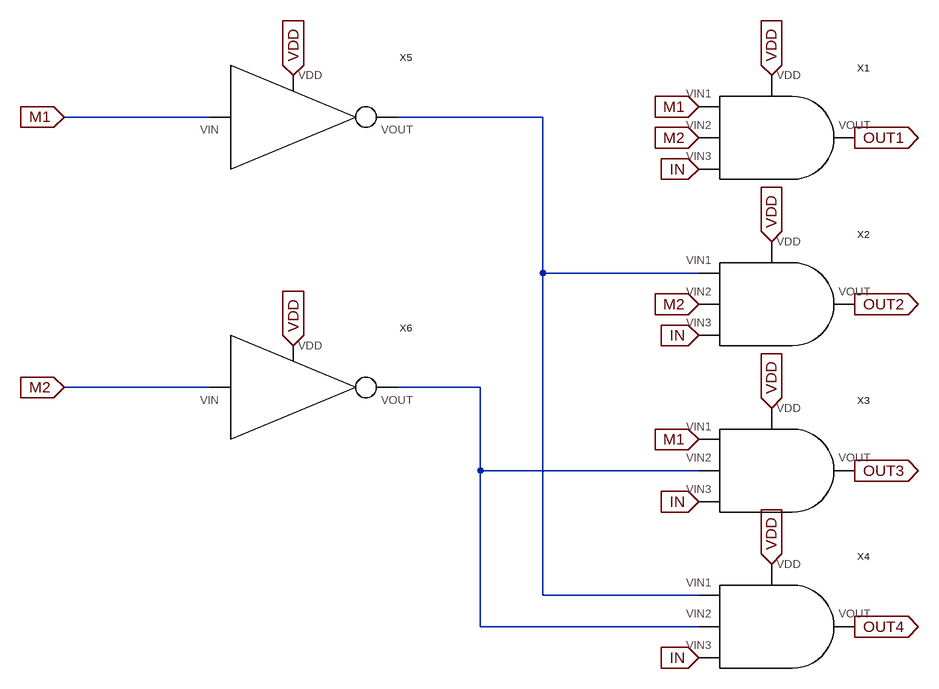
[diagram p0: schematic demultiplexer.asc]
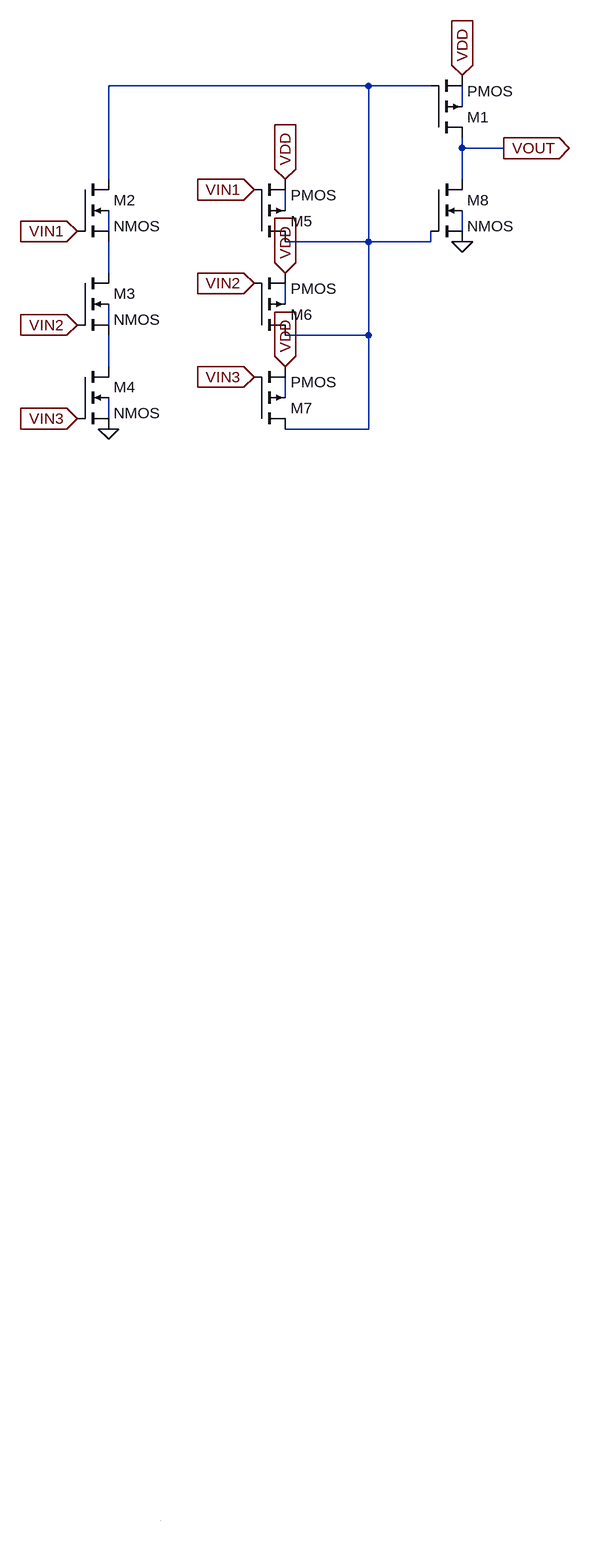
[diagram p1: sub-circuit and3.asc]
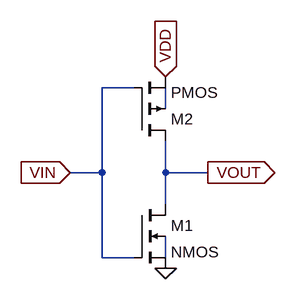
[diagram p2: sub-circuit not.asc]
demultiplexer.asc, the LTspice schematic file:
Version 4
SHEET 1 1080 680
WIRE -1040 -320 -1264 -320
WIRE -528 -320 -752 -320
WIRE -528 -80 -528 -320
WIRE -288 -80 -528 -80
WIRE -1040 96 -1264 96
WIRE -624 96 -752 96
WIRE -624 224 -624 96
WIRE -288 224 -624 224
WIRE -528 416 -528 -80
WIRE -288 416 -528 416
WIRE -624 464 -624 224
WIRE -288 464 -624 464
FLAG -176 -384 VDD
IOPIN -176 -384 In
FLAG -176 -128 VDD
IOPIN -176 -128 In
FLAG -176 128 VDD
IOPIN -176 128 In
FLAG -176 368 VDD
IOPIN -176 368 In
FLAG -912 32 VDD
IOPIN -912 32 In
FLAG -912 -384 VDD
IOPIN -912 -384 In
FLAG -1264 -320 M1
IOPIN -1264 -320 In
FLAG -288 -336 M1
IOPIN -288 -336 In
FLAG -288 176 M1
IOPIN -288 176 In
FLAG -1264 96 M2
IOPIN -1264 96 In
FLAG -288 -288 M2
IOPIN -288 -288 In
FLAG -288 -32 M2
IOPIN -288 -32 In
FLAG -288 512 IN
IOPIN -288 512 In
FLAG -288 272 IN
IOPIN -288 272 In
FLAG -288 16 IN
IOPIN -288 16 In
FLAG -288 -240 IN
IOPIN -288 -240 In
FLAG -48 -288 OUT1
IOPIN -48 -288 Out
FLAG -48 -32 OUT2
IOPIN -48 -32 Out
FLAG -48 224 OUT3
IOPIN -48 224 Out
FLAG -48 464 OUT4
IOPIN -48 464 Out
SYMBOL and3 -176 -288 R0
SYMATTR InstName X1
SYMBOL and3 -176 -32 R0
SYMATTR InstName X2
SYMBOL and3 -176 224 R0
SYMATTR InstName X3
SYMBOL and3 -176 464 R0
SYMATTR InstName X4
SYMBOL not -912 -320 R0
SYMATTR InstName X5
SYMBOL not -912 96 R0
SYMATTR InstName X6

and3.asc, the sub-circuit schematic file:
Version 4
SHEET 1 880 680
WIRE 320 -2208 -80 -2208
WIRE 416 -2208 320 -2208
WIRE 464 -2176 464 -2208
WIRE 464 -2112 464 -2128
WIRE 528 -2112 464 -2112
WIRE -80 -2064 -80 -2208
WIRE 464 -2064 464 -2112
WIRE 192 -2016 192 -2048
WIRE -80 -1984 -80 -2016
WIRE 464 -1984 464 -2016
WIRE 320 -1968 320 -2208
WIRE 320 -1968 192 -1968
WIRE 416 -1968 416 -1984
WIRE 416 -1968 320 -1968
WIRE -80 -1920 -80 -1968
WIRE 192 -1872 192 -1904
WIRE -80 -1840 -80 -1872
WIRE 320 -1824 320 -1968
WIRE 320 -1824 192 -1824
WIRE -80 -1776 -80 -1824
WIRE 192 -1728 192 -1760
WIRE -80 -1696 -80 -1728
WIRE 320 -1680 320 -1824
WIRE 320 -1680 192 -1680
WIRE 0 0 0 0
FLAG -80 -1680 0
FLAG -128 -1984 VIN1
IOPIN -128 -1984 In
FLAG -128 -1840 VIN2
IOPIN -128 -1840 In
FLAG -128 -1696 VIN3
IOPIN -128 -1696 In
FLAG 464 -2224 VDD
IOPIN 464 -2224 In
FLAG 528 -2112 VOUT
IOPIN 528 -2112 Out
FLAG 464 -1968 0
FLAG 144 -2048 VIN1
IOPIN 144 -2048 In
FLAG 144 -1904 VIN2
IOPIN 144 -1904 In
FLAG 144 -1760 VIN3
IOPIN 144 -1760 In
FLAG 192 -2064 VDD
IOPIN 192 -2064 In
FLAG 192 -1920 VDD
IOPIN 192 -1920 In
FLAG 192 -1776 VDD
IOPIN 192 -1776 In
SYMBOL nmos4 -128 -2064 R0
SYMATTR InstName M2
SYMATTR Value2 l=90n w=200n
SYMBOL nmos4 -128 -1920 R0
SYMATTR InstName M3
SYMATTR Value2 l=90n w=200n
SYMBOL nmos4 -128 -1776 R0
SYMATTR InstName M4
SYMATTR Value2 l=90n w=200n
SYMBOL pmos4 416 -2128 M180
SYMATTR InstName M1
SYMATTR Value2 l=90n w=400n
SYMBOL pmos4 144 -1968 M180
SYMATTR InstName M5
SYMATTR Value2 l=90n w=400n
SYMBOL pmos4 144 -1824 M180
SYMATTR InstName M6
SYMATTR Value2 l=90n w=400n
SYMBOL pmos4 144 -1680 M180
SYMATTR InstName M7
SYMATTR Value2 l=90n w=400n
SYMBOL nmos4 416 -2064 R0
SYMATTR InstName M8
SYMATTR Value2 l=90n w=200n

not.asc, the sub-circuit schematic file:
Version 4
SHEET 1 1208 680
WIRE 640 80 592 80
WIRE 688 112 688 80
WIRE 592 208 592 80
WIRE 592 208 544 208
WIRE 688 208 688 160
WIRE 752 208 688 208
WIRE 688 256 688 208
WIRE 592 336 592 208
WIRE 640 336 592 336
WIRE 688 336 688 304
FLAG 544 208 VIN
IOPIN 544 208 In
FLAG 752 208 VOUT
IOPIN 752 208 Out
FLAG 688 352 0
FLAG 688 64 VDD
IOPIN 688 64 In
SYMBOL nmos4 640 256 R0
SYMATTR InstName M1
SYMATTR Value2 l=90n w=200n
SYMBOL pmos4 640 160 M180
SYMATTR InstName M2
SYMATTR Value2 l=90n w=400n

The netlist it stands for:
* demultiplexer.asc
XX1 M1 M2 IN VDD OUT1 and3
XX2 N001 M2 IN VDD OUT2 and3
XX3 M1 N002 IN VDD OUT3 and3
XX4 N001 N002 IN VDD OUT4 and3
XX5 VDD M1 N001 not
XX6 VDD M2 N002 not

* block symbol definitions
.subckt and3 VIN1 VIN2 VIN3 VDD VOUT
M2 N001 VIN1 N006 N004 NMOS l=90n w=200n
M3 N006 VIN2 N009 N008 NMOS l=90n w=200n
M4 N009 VIN3 0 N011 NMOS l=90n w=200n
M1 VOUT N001 VDD N002 PMOS l=90n w=400n
M5 N001 VIN1 VDD N003 PMOS l=90n w=400n
M6 N001 VIN2 VDD N007 PMOS l=90n w=400n
M7 N001 VIN3 VDD N010 PMOS l=90n w=400n
M8 VOUT N001 0 N005 NMOS l=90n w=200n
.ends and3

.subckt not VDD VIN VOUT
M1 VOUT VIN 0 N002 NMOS l=90n w=200n
M2 VOUT VIN VDD N001 PMOS l=90n w=400n
.ends not

.model NMOS NMOS
.model PMOS PMOS
.lib standard.mos
.backanno
.end